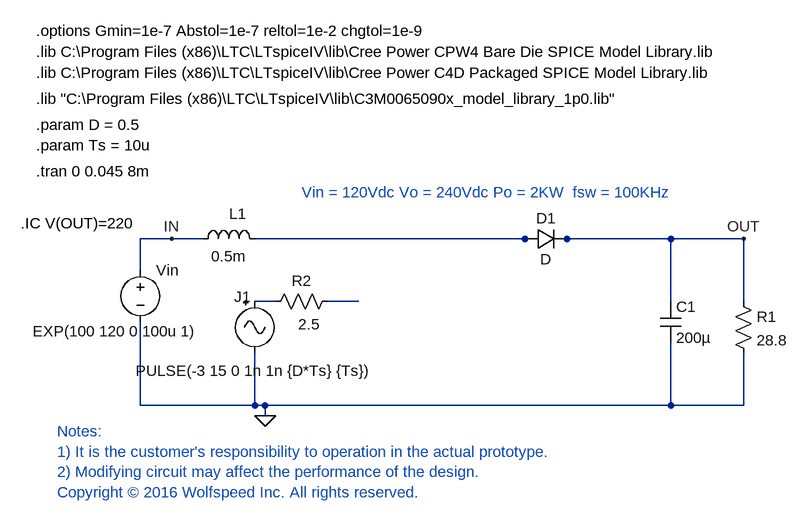
[diagram p0: schematic 2KW Boost converter.asc]
2KW Boost converter.asc, the LTspice schematic file:
Version 4
SHEET 1 1364 680
WIRE -736 -64 -784 -64
WIRE -688 -64 -736 -64
WIRE -192 -64 -608 -64
WIRE -176 -64 -192 -64
WIRE -128 -64 -144 -64
WIRE 32 -64 -128 -64
WIRE 144 -64 32 -64
WIRE -784 -16 -784 -64
WIRE -576 32 -608 32
WIRE -448 32 -496 32
WIRE 32 32 32 -64
WIRE 144 32 144 -64
WIRE -784 192 -784 64
WIRE -608 192 -608 112
WIRE -608 192 -784 192
WIRE -592 192 -608 192
WIRE 32 192 32 96
WIRE 32 192 -592 192
WIRE 144 192 144 112
WIRE 144 192 32 192
WIRE -592 208 -592 192
FLAG -592 208 0
FLAG 144 -64 OUT
FLAG -736 -64 IN
SYMBOL voltage -784 -32 R0
WINDOW 123 0 0 Left 2
WINDOW 39 0 0 Left 2
WINDOW 3 -166 110 Left 2
SYMATTR Value EXP(100 120 0 100u 1)
SYMATTR InstName Vin
SYMBOL ind -704 -48 R270
WINDOW 0 39 70 VTop 2
WINDOW 3 5 56 VBottom 2
SYMATTR InstName L1
SYMATTR Value 0.5m
SYMATTR SpiceLine Rser=0
SYMBOL cap 16 32 R0
SYMATTR InstName C1
SYMATTR Value 200µ
SYMBOL Misc\\signal -608 16 R0
WINDOW 0 -19 -7 Top 2
WINDOW 3 -1 138 Bottom 2
WINDOW 123 0 0 Left 2
WINDOW 39 -60 56 VBottom 2
SYMATTR InstName J1
SYMATTR Value PULSE(-3 15 0 1n 1n {D*Ts} {Ts})
SYMBOL res 128 16 R0
SYMATTR InstName R1
SYMATTR Value 28.8
SYMBOL res -480 16 R90
WINDOW 0 0 56 VBottom 2
WINDOW 3 36 44 VTop 2
SYMATTR InstName R2
SYMATTR Value 2.5
SYMBOL diode -192 -48 R270
WINDOW 0 32 32 VTop 2
WINDOW 3 0 32 VBottom 2
SYMATTR InstName D1
TEXT -944 -240 Left 2 !.param D = 0.5
TEXT -944 -208 Left 2 !.param Ts = 10u
TEXT -944 -320 Left 2 !.lib C:\\Program Files (x86)\\LTC\\LTspiceIV\\lib\\Cree Power C4D Packaged SPICE Model Library.lib
TEXT -944 -280 Left 2 !.lib "C:\\Program Files (x86)\\LTC\\LTspiceIV\\lib\\C3M0065090x_model_library_1p0.lib"
TEXT -944 -168 Left 2 !.tran 0 0.045 8m
TEXT -536 -136 Left 2 ;Vin = 120Vdc Vo = 240Vdc Po = 2KW  fsw = 100KHz
TEXT -944 -352 Left 2 !.lib C:\\Program Files (x86)\\LTC\\LTspiceIV\\lib\\Cree Power CPW4 Bare Die SPICE Model Library.lib
TEXT -944 -384 Left 2 !.options Gmin=1e-7 Abstol=1e-7 reltol=1e-2 chgtol=1e-9
TEXT -968 -88 Left 2 !.IC V(OUT)=220
TEXT -912 232 Left 2 ;Notes:\n1) It is the customer's responsibility to operation in the actual prototype.\n2) Modifying circuit may affect the performance of the design.\nCopyright © 2016 Wolfspeed Inc. All rights reserved.

The netlist it stands for:
* 2KW Boost converter.asc
Vin IN 0 EXP(100 120 0 100u 1)
L1 IN N001 0.5m Rser=0
C1 OUT 0 200µ
V§J1 N002 0 PULSE(-3 15 0 1n 1n {D*Ts} {Ts})
R1 OUT 0 28.8
R2 N003 N002 2.5
D1 N001 OUT D
.model D D
.lib standard.dio
.param D = 0.5
.param Ts = 10u
.lib C:\Program Files (x86)\LTC\LTspiceIV\lib\Cree Power C4D Packaged SPICE Model Library.lib
.lib "C:\Program Files (x86)\LTC\LTspiceIV\lib\C3M0065090x_model_library_1p0.lib"
.tran 0 0.045 8m
* Vin = 120Vdc Vo = 240Vdc Po = 2KW  fsw = 100KHz
.lib C:\Program Files (x86)\LTC\LTspiceIV\lib\Cree Power CPW4 Bare Die SPICE Model Library.lib
.options Gmin=1e-7 Abstol=1e-7 reltol=1e-2 chgtol=1e-9
.IC V(OUT)=220
* Notes:
* 1) It is the customer's responsibility to operation in the actual prototype.
* 2) Modifying circuit may affect the performance of the design.
* Copyright © 2016 Wolfspeed Inc. All rights reserved.
.backanno
.end